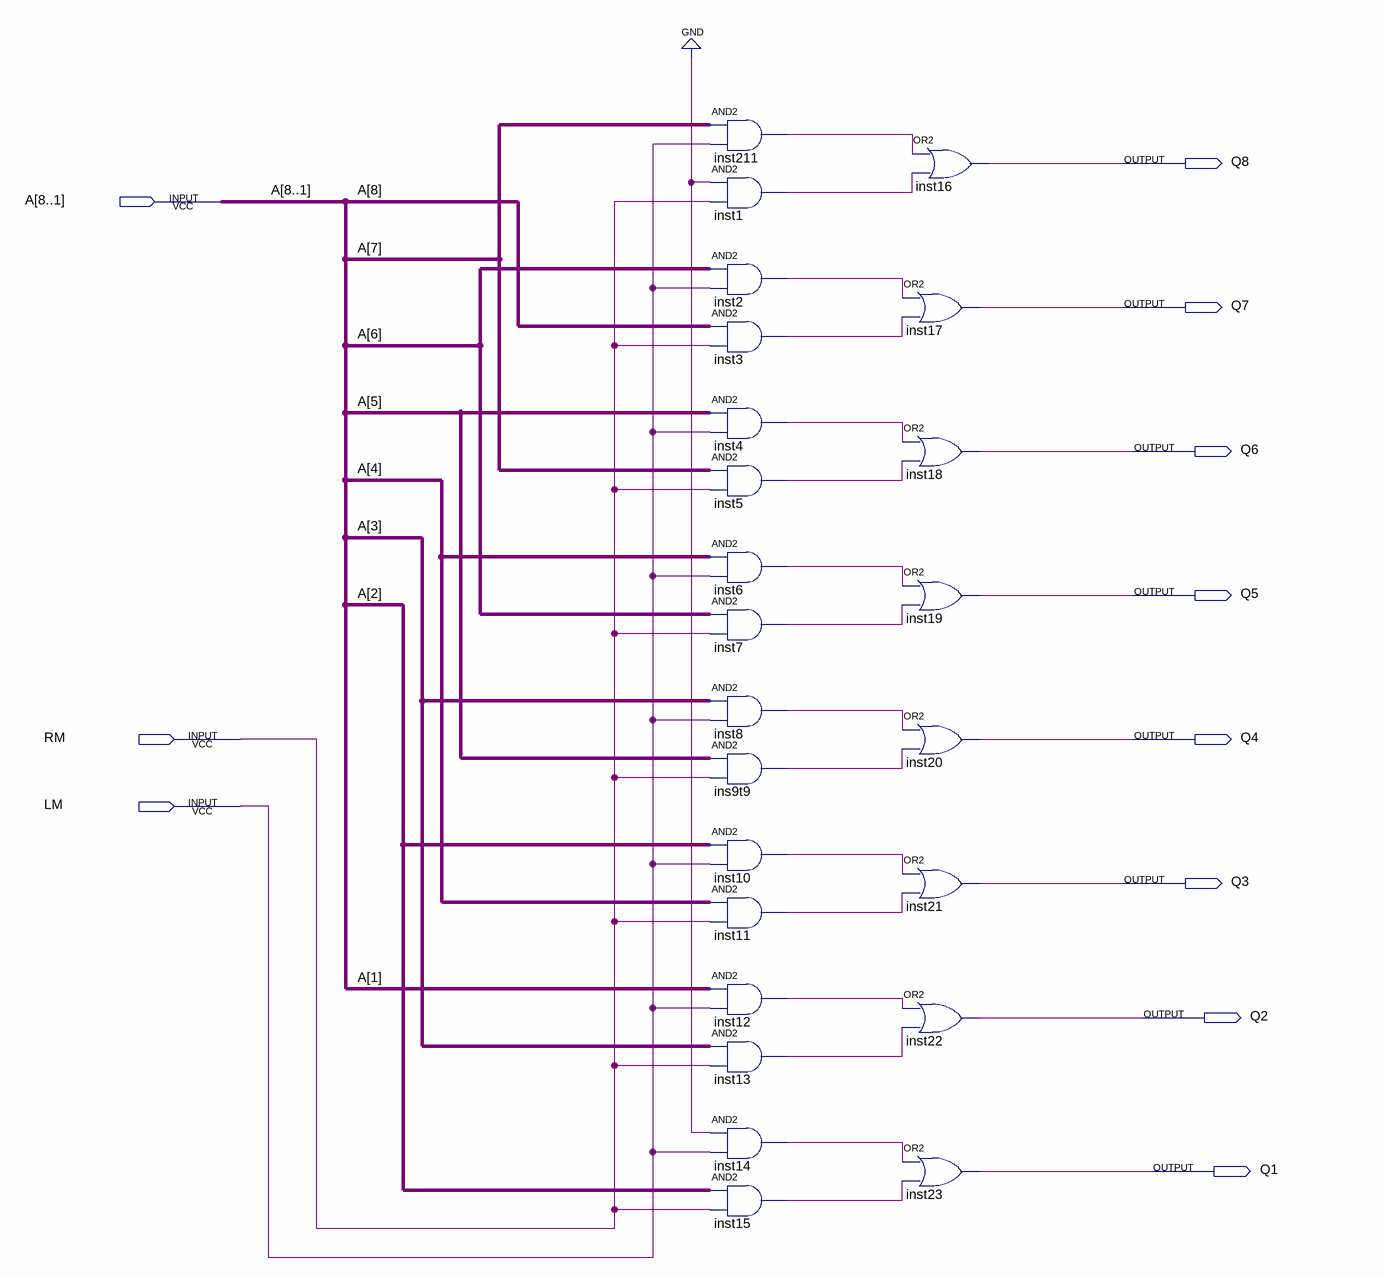
[diagram p0: schematic sheet]
// Quartus schematic shifter.bdf as structural Verilog: 24 symbols, 11 pins
module shifter (
  input  [8:1] A,
  input  RM,
  input  LM,
  output Q8,
  output Q7,
  output Q6,
  output Q5,
  output Q4,
  output Q3,
  output Q2,
  output Q1
);

  wire ins9t9_out, inst1_out, inst2_out, inst3_out, inst4_out, inst5_out, inst6_out, inst7_out, inst8_out,
       inst10_out, inst11_out, inst12_out, inst13_out, inst14_out, inst15_out, inst211_out;

  and inst211 (inst211_out, A[7], LM);
  and inst1 (inst1_out, 1'b0, RM);
  and inst2 (inst2_out, A[6], LM);
  and inst3 (inst3_out, A[8], RM);
  and inst4 (inst4_out, A[5], LM);
  and inst5 (inst5_out, A[7], RM);
  and inst6 (inst6_out, A[4], LM);
  and inst7 (inst7_out, A[6], RM);
  and inst8 (inst8_out, A[3], LM);
  and ins9t9 (ins9t9_out, A[5], RM);
  and inst10 (inst10_out, A[2], LM);
  and inst11 (inst11_out, A[4], RM);
  and inst12 (inst12_out, A[1], LM);
  and inst13 (inst13_out, A[3], RM);
  and inst14 (inst14_out, 1'b0, LM);
  and inst15 (inst15_out, A[2], RM);
  or inst16 (Q8, inst211_out, inst1_out);
  or inst17 (Q7, inst2_out, inst3_out);
  or inst18 (Q6, inst4_out, inst5_out);
  or inst19 (Q5, inst6_out, inst7_out);
  or inst20 (Q4, inst8_out, ins9t9_out);
  or inst21 (Q3, inst10_out, inst11_out);
  or inst22 (Q2, inst12_out, inst13_out);
  or inst23 (Q1, inst14_out, inst15_out);
endmodule
